# EAGLE design bal (EAGLE 8.1.1)
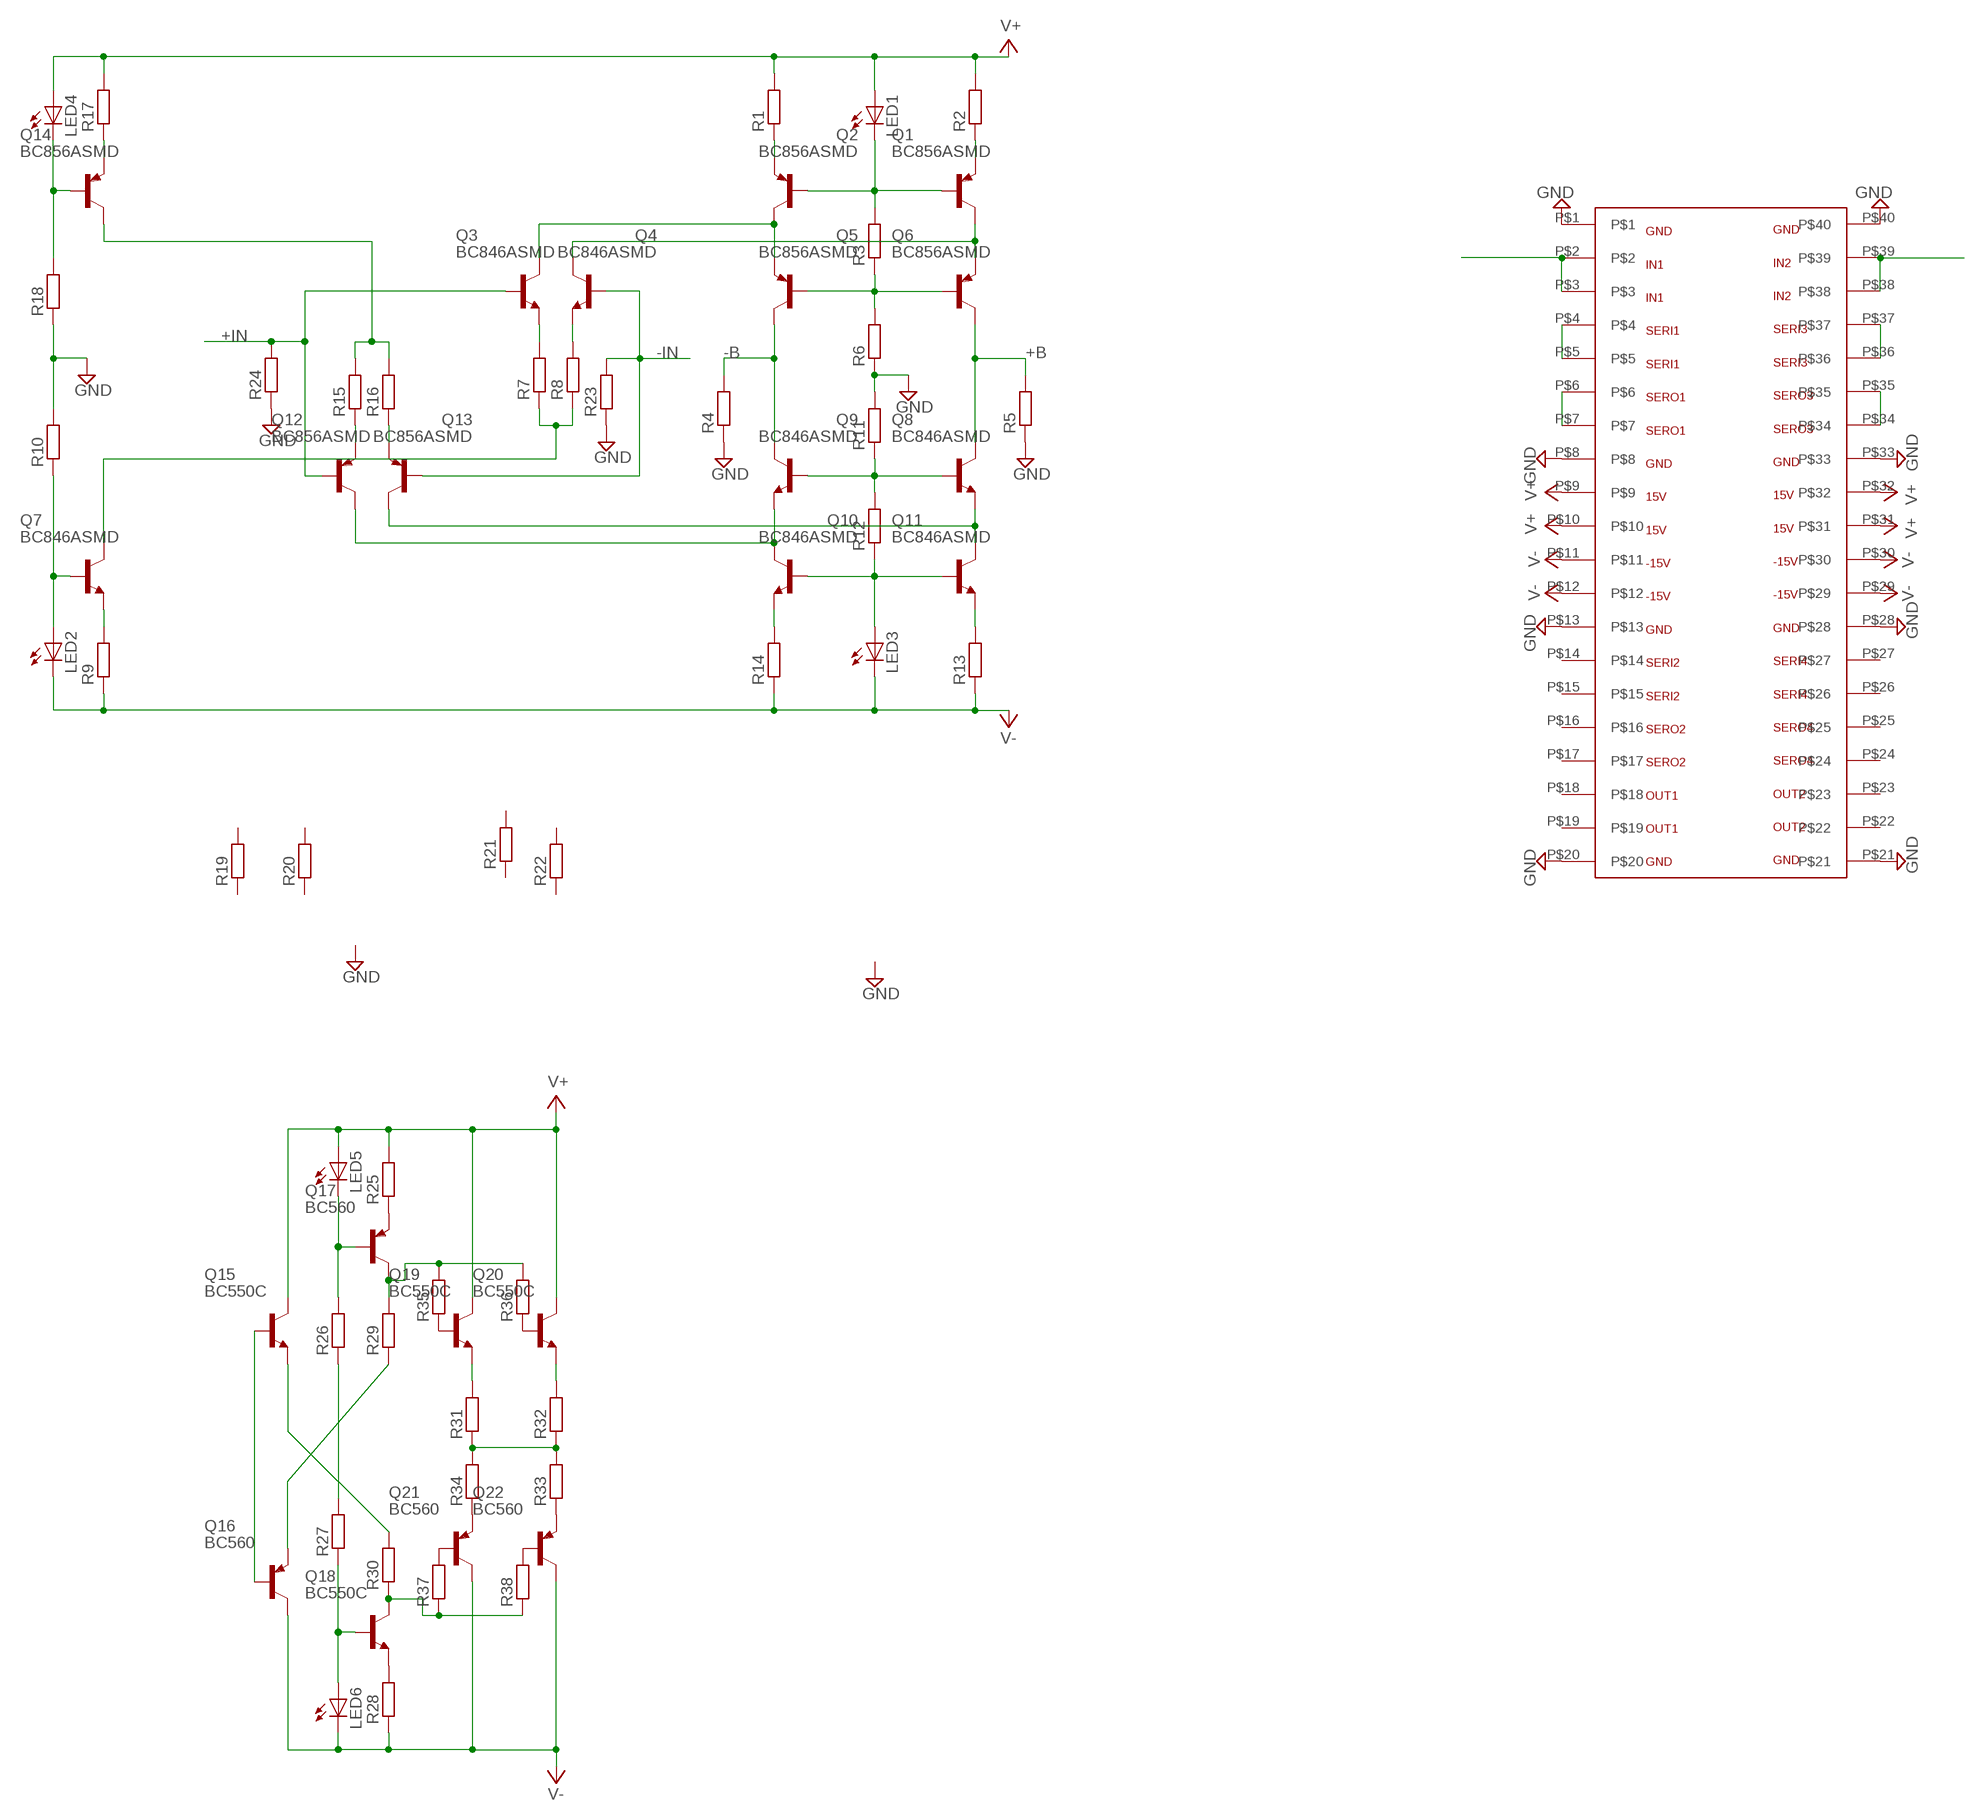
[diagram p0: schematic, sheet 1]

## Parts
LED1  LED5MM  [LED5MM]
LED2  LED5MM  [LED5MM]
LED3  LED5MM  [LED5MM]
LED4  LED5MM  [LED5MM]
LED5  LED5MM  [LED5MM]
LED6  LED5MM  [LED5MM]
Q1  BC856ASMD  [SOT23-BEC]
Q2  BC856ASMD  [SOT23-BEC]
Q3  BC846ASMD  [SOT23]
Q4  BC846ASMD  [SOT23]
Q5  BC856ASMD  [SOT23-BEC]
Q6  BC856ASMD  [SOT23-BEC]
Q7  BC846ASMD  [SOT23]
Q8  BC846ASMD  [SOT23]
Q9  BC846ASMD  [SOT23]
Q10  BC846ASMD  [SOT23]
Q11  BC846ASMD  [SOT23]
Q12  BC856ASMD  [SOT23-BEC]
Q13  BC856ASMD  [SOT23-BEC]
Q14  BC856ASMD  [SOT23-BEC]
Q15  BC550C  [TO92-EBC]
Q16  BC560  [TO92_1]
Q17  BC560  [TO92_1]
Q18  BC550C  [TO92-EBC]
Q19  BC550C  [TO92-EBC]
Q20  BC550C  [TO92-EBC]
Q21  BC560  [TO92_1]
Q22  BC560  [TO92_1]
R1  R-EU_MELF0204W  [MINI_MELF-0204W]
R2  R-EU_MELF0204W  [MINI_MELF-0204W]
R3  R-EU_MELF0204W  [MINI_MELF-0204W]
R4  R-EU_MELF0204W  [MINI_MELF-0204W]
R5  R-EU_MELF0204W  [MINI_MELF-0204W]
R6  R-EU_MELF0204W  [MINI_MELF-0204W]
R7  R-EU_MELF0204W  [MINI_MELF-0204W]
R8  R-EU_MELF0204W  [MINI_MELF-0204W]
R9  R-EU_MELF0204W  [MINI_MELF-0204W]
R10  R-EU_MELF0204W  [MINI_MELF-0204W]
R11  R-EU_MELF0204W  [MINI_MELF-0204W]
R12  R-EU_MELF0204W  [MINI_MELF-0204W]
R13  R-EU_MELF0204W  [MINI_MELF-0204W]
R14  R-EU_MELF0204W  [MINI_MELF-0204W]
R15  R-EU_MELF0204W  [MINI_MELF-0204W]
R16  R-EU_MELF0204W  [MINI_MELF-0204W]
R17  R-EU_MELF0204W  [MINI_MELF-0204W]
R18  R-EU_MELF0204W  [MINI_MELF-0204W]
R19  R-EU_MELF0204W  [MINI_MELF-0204W]
R20  R-EU_MELF0204W  [MINI_MELF-0204W]
R21  R-EU_MELF0204W  [MINI_MELF-0204W]
R22  R-EU_MELF0204W  [MINI_MELF-0204W]
R23  R-EU_MELF0204W  [MINI_MELF-0204W]
R24  R-EU_MELF0204W  [MINI_MELF-0204W]
R25  R-EU_MELF0204W  [MINI_MELF-0204W]
R26  R-EU_MELF0204W  [MINI_MELF-0204W]
R27  R-EU_MELF0204W  [MINI_MELF-0204W]
R28  R-EU_MELF0204W  [MINI_MELF-0204W]
R29  R-EU_MELF0204W  [MINI_MELF-0204W]
R30  R-EU_MELF0204W  [MINI_MELF-0204W]
R31  R-EU_MELF0204W  [MINI_MELF-0204W]
R32  R-EU_MELF0204W  [MINI_MELF-0204W]
R33  R-EU_MELF0204W  [MINI_MELF-0204W]
R34  R-EU_MELF0204W  [MINI_MELF-0204W]
R35  R-EU_MELF0204W  [MINI_MELF-0204W]
R36  R-EU_MELF0204W  [MINI_MELF-0204W]
R37  R-EU_MELF0204W  [MINI_MELF-0204W]
R38  R-EU_MELF0204W  [MINI_MELF-0204W]
U$1  VDACA  [VDACA]

## Nets
+B: Q6.C Q8.3(C) R5.2
+IN: Q3.1(B) Q12.B R24.2 U$1.P$2 U$1.P$3
-B: Q5.C Q9.3(C) R4.2
-IN: Q4.1(B) Q13.B R23.2 U$1.P$38 U$1.P$39
GND: R4.1 R5.1 R6.1 R10.2 R11.2 R18.1 R23.1 R24.1 U$1.P$1 U$1.P$8 U$1.P$13 U$1.P$20 U$1.P$21 U$1.P$28 U$1.P$33 U$1.P$40
N$1: U$1.P$4 U$1.P$5
N$2: Q1.E R2.1
N$3: Q2.E R1.1
N$4: LED1.K(C) Q1.B Q2.B R3.2
N$5: Q5.B Q6.B R3.1 R6.2
N$6: Q1.C Q4.3(C) Q6.E
N$7: Q2.C Q3.3(C) Q5.E
N$8: Q8.1(B) Q9.1(B) R11.1 R12.2
N$9: U$1.P$36 U$1.P$37
N$10: U$1.P$6 U$1.P$7
N$11: U$1.P$34 U$1.P$35
N$12: Q9.2(E) Q10.3(C) Q12.C
N$13: LED3.A Q10.1(B) Q11.1(B) R12.1
N$14: Q8.2(E) Q11.3(C) Q13.C
N$15: Q16.3(E) R29.1
N$16: Q10.2(E) R14.2
N$17: Q11.2(E) R13.2
N$19: Q4.2(E) R8.2
N$20: Q3.2(E) R7.2
N$21: Q7.3(C) R7.1 R8.1
N$22: Q14.E R17.1
N$23: LED4.K(C) Q14.B R18.2
N$24: Q7.2(E) R9.2
N$25: Q14.C R15.2 R16.2
N$26: LED2.A Q7.1(B) R10.1
N$27: LED5.K(C) Q17.2(B) R26.2
N$28: Q13.E R16.1
N$29: Q12.E R15.1
N$30: Q17.3(E) R25.1
N$31: R26.1 R27.2
N$33: Q15.E R30.2
N$34: LED6.A Q18.B R27.1
N$35: Q18.E R28.2
N$36: Q17.1(C) R29.2 R35.2 R36.2
N$37: Q18.C R30.1 R37.1 R38.1
N$38: Q15.B Q16.2(B)
N$39: Q19.E R31.2
N$40: Q20.E R32.2
N$41: Q22.3(E) R33.1
N$42: Q21.3(E) R34.1
N$43: Q21.2(B) R37.2
N$44: R31.1 R32.1 R33.2 R34.2
N$45: Q19.B R35.1
N$46: Q20.B R36.1
N$47: Q22.2(B) R38.2
V+: LED1.A LED4.A LED5.A Q15.C Q19.C Q20.C R1.2 R2.2 R17.2 R25.2 U$1.P$9 U$1.P$10 U$1.P$31 U$1.P$32
V-: LED2.K(C) LED3.K(C) LED6.K(C) Q16.1(C) Q21.1(C) Q22.1(C) R9.1 R13.1 R14.1 R28.1 U$1.P$11 U$1.P$12 U$1.P$29 U$1.P$30
Unconnected: R19.1 R19.2 R20.1 R20.2 R21.1 R21.2 R22.1 R22.2 U$1.P$14 U$1.P$15 U$1.P$16 U$1.P$17 U$1.P$18 U$1.P$19 U$1.P$22 U$1.P$23 U$1.P$24 U$1.P$25 U$1.P$26 U$1.P$27

## Library data of the parts
LED1-LED6 = led:LED: LED OSRAM: - CHIPLED LG R971, LG N971, LY N971, LG Q971, LY Q971, LO R971, LY R971 LH N974, LH R974 LS Q976, LO Q976, LY Q976 LO Q996 - Hyper CHIPLED LW Q18S LB Q993, LB Q99A, LB R99A - SideLED LS A670, LO A670, LY A670, LG A670, LP A670 LB A673, LV A673, LT A673, LW A673 LH A674 LY A675 LS A676, LA A676, LO A676, LY A676, LW A676 LS A679, LY A679, LG A679 - Hyper Micro SIDELED® LS Y876, LA Y876, LO Y876, LY Y876 LT Y87S - SmartLED LW L88C, LW L88S LB L89C, LB L89S, LG L890 LS L89K, LO L89K, LY L89K LS L896, LA L896, LO L896, LY L896 - TOPLED LS T670, LO T670, LY T670, LG T670, LP T670 LSG T670, LSP T670, LSY T670, LOP T670, LYG T670 LG T671, LOG T671, LSG T671 LB T673, LV T673, LT T673, LW T673 LH T674 LS T676, LA T676, LO T676, LY T676, LB T676, LH T676, LSB T676, LW T676 LB T67C, LV T67C, LT T67C, LS T67K, LO T67K, LY T67K, LW E67C LS E67B, LA E67B, LO E67B, LY E67B, LB E67C, LV E67C, LT E67C LW T67C LS T679, LY T679, LG T679 LS T770, LO T770, LY T770, LG T770, LP T770 LB T773, LV T773, LT T773, LW T773 LH T774 LS E675, LA E675, LY E675, LS T675 LS T776, LA T776, LO T776, LY T776, LB T776 LHGB T686 LT T68C, LB T68C - Hyper Mini TOPLED® LB M676 - Mini TOPLED Santana® LG M470 LS M47K, LO M47K, LY M47K Source: http://www.osram.convergy.de LUXEON: - LUMILED® LXK2-PW12-R00, LXK2-PW12-S00, LXK2-PW14-U00, LXK2-PW14-V00 LXK2-PM12-R00, LXK2-PM12-S00, LXK2-PM14-U00 LXK2-PE12-Q00, LXK2-PE12-R00, LXK2-PE12-S00, LXK2-PE14-T00, LXK2-PE14-U00 LXK2-PB12-K00, LXK2-PB12-L00, LXK2-PB12-M00, LXK2-PB14-N00, LXK2-PB14-P00, LXK2-PB14-Q00 LXK2-PR12-L00, LXK2-PR12-M00, LXK2-PR14-Q00, LXK2-PR14-R00 LXK2-PD12-Q00, LXK2-PD12-R00, LXK2-PD12-S00 LXK2-PH12-R00, LXK2-PH12-S00 LXK2-PL12-P00, LXK2-PL12-Q00, LXK2-PL12-R00 Source: www.luxeon.com KINGBRIGHT: KA-3528ASYC Source: www.kingbright.com
Q1 Q2 Q5 Q6 Q12-Q14 = tranzistory SMD PNP:BC856*: PNP Transistror
Q3 Q4 Q7-Q11 = tranzistory SMD NPN:BC846*: NPN Transistor
Q15 Q18-Q20 = tranzistory NPN:BC550*: NPN Transistor
Q16 Q17 Q21 Q22 = tranzistory PNP:BC560*: PNP Transistror
R1-R38 = Vwvwbg:R-EU_: RESISTOR, European symbol
U$1 = Vwvwbg:VDACA

## Board
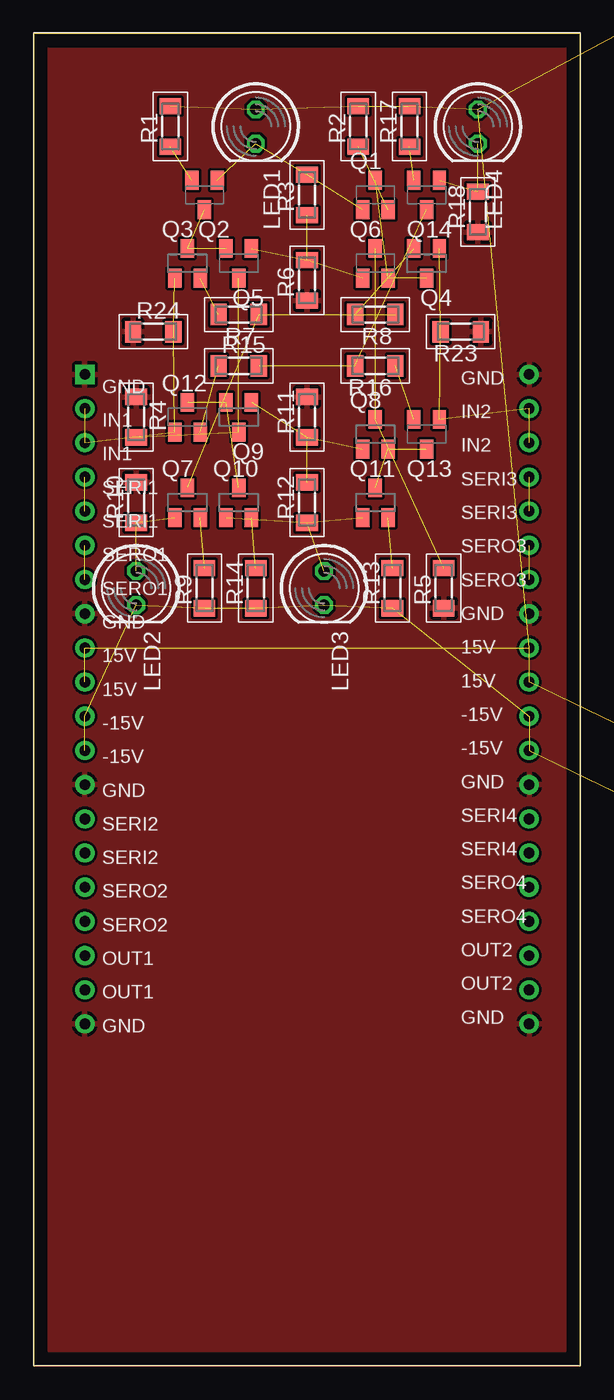
[diagram p1: board, top side]

Size 40.63 x 98.97 mm. Coordinates in mm from the lower left corner, seen from the top.
Outline: 0,0 40.63,0 40.63,98.97 0,98.97 0,0
Copper layers (1*16): Top 0.035mm / dielectric 1.5mm / Bottom 0.035mm
Design rules "default": minimum track width 10mil, minimum drill 24mil, track to track 8mil, track to pad 8mil, pad to pad 8mil, via to via 8mil, smd to smd 8mil, copper to edge 40mil, drill to drill 8mil, minimum pad ring 10mil, minimum via ring 8mil, stop-mask expansion 4mil, vias tented up to drill 0mil, thermal gap 10mil

### Footprints (pad centres in the part's own frame; a part is rotated, then mirrored left to right if it is on the bottom)
LED5MM = drill 0.813 octagon: A -1.27,0; K 1.27,0
SOT23-BEC = smd 1 x 1.4: B -0.95,-1.1; C 0,1.1; E 0.95,-1.1
SOT23 = smd 1 x 1.4: 1 -0.95,-1.1; 2 0.95,-1.1; 3 0,1.1
TO92-EBC = drill 0.813 pad 1.422: B 0,-1.27; C -2.54,-1.27; E 2.54,-1.27
TO92_1 = drill 0.813 pad 1.422: 1 -2.54,0; 2 0,0; 3 2.54,0
MINI_MELF-0204W = smd 1.2 x 1.6: 1 -1.5,0; 2 1.5,0
VDACA = drill 0.8 pad 1.422 square: P$1 1.27,-19.05 | drill 0.8 pad 1.422: P$2 1.27,-21.59; P$3 1.27,-24.13; P$4 1.27,-26.67; P$5 1.27,-29.21; P$6 1.27,-31.75; P$7 1.27,-34.29; P$8 1.27,-36.83; P$9 1.27,-39.37; P$10 1.27,-41.91; P$11 1.27,-44.45; P$12 1.27,-46.99; P$13 1.27,-49.53; P$14 1.27,-52.07; P$15 1.27,-54.61; P$16 1.27,-57.15; P$17 1.27,-59.69; P$18 1.27,-62.23; P$19 1.27,-64.77; P$20 1.27,-67.31; P$21 34.29,-67.31; P$22 34.29,-64.77; P$23 34.29,-62.23; P$24 34.29,-59.69; P$25 34.29,-57.15; P$26 34.29,-54.61; P$27 34.29,-52.07; P$28 34.29,-49.53; P$29 34.29,-46.99; P$30 34.29,-44.45; P$31 34.29,-41.91; P$32 34.29,-39.37; P$33 34.29,-36.83; P$34 34.29,-34.29; P$35 34.29,-31.75; P$36 34.29,-29.21; P$37 34.29,-26.67; P$38 34.29,-24.13; P$39 34.29,-21.59; P$40 34.29,-19.05

### Placement (x,y rotation side)
LED1  16.51,92.08 270 top
LED2  7.62,57.78 270 top
LED3  21.59,57.78 270 top
LED4  33.02,92.08 270 top
LED5  130.81,7.62 90 top  (outside the outline)
LED6  104.14,8.89 270 top  (outside the outline)
Q1  25.4,87 0 top
Q2  12.7,87 180 top
Q3  11.43,81.92 0 top
Q4  29.21,81.92 180 top
Q5  15.24,81.92 180 top
Q6  25.4,81.92 0 top
Q7  11.43,64.14 0 top
Q8  25.4,69.22 0 top
Q9  15.24,70.48 180 top
Q10  15.24,64.14 0 top
Q11  25.4,64.14 0 top
Q12  11.43,70.48 0 top
Q13  29.21,69.22 180 top
Q14  29.21,87 180 top
Q15  110.49,17.78 0 top  (outside the outline)
Q16  124.46,16.51 180 top  (outside the outline)
Q17  124.46,11.43 0 top  (outside the outline)
Q18  110.49,11.43 180 top  (outside the outline)
Q19  127,1.27 180 top  (outside the outline)
Q20  127,-3.81 180 top  (outside the outline)
Q21  109.22,2.54 0 top  (outside the outline)
Q22  109.22,-2.54 0 top  (outside the outline)
R1  10.16,92.08 90 top
R2  24.13,92.08 90 top
R3  20.32,87 90 top
R4  7.62,70.48 270 top
R5  30.48,57.78 90 top
R6  20.32,80.64 90 top
R7  15.24,78.11 180 top
R8  25.4,78.11 180 top
R9  12.7,57.78 90 top
R10  7.62,64.14 90 top
R11  20.32,70.48 90 top
R12  20.32,64.14 90 top
R13  26.67,57.78 90 top
R14  16.51,57.78 90 top
R15  15.24,74.3 0 top
R16  25.4,74.3 180 top
R17  27.94,92.08 90 top
R18  33.02,85.72 90 top
R19  -35.56,45.72 0 top  (outside the outline)
R20  -41.91,45.72 0 top  (outside the outline)
R21  -41.91,-5.08 0 top  (outside the outline)
R22  -41.91,-11.43 0 top  (outside the outline)
R23  31.75,76.83 180 top
R24  8.89,76.83 0 top
R25  96.52,128.27 0 top  (outside the outline)
R26  96.52,107.95 0 top  (outside the outline)
R27  96.52,101.6 0 top  (outside the outline)
R28  104.14,13.97 0 top  (outside the outline)
R29  119.38,13.97 270 top  (outside the outline)
R30  115.57,13.97 90 top  (outside the outline)
R31  120.65,2.54 0 top  (outside the outline)
R32  120.65,-2.54 0 top  (outside the outline)
R33  115.57,-2.54 0 top  (outside the outline)
R34  115.57,2.54 0 top  (outside the outline)
R35  124.46,7.62 180 top  (outside the outline)
R36  124.46,-6.35 180 top  (outside the outline)
R37  110.49,7.62 180 top  (outside the outline)
R38  110.49,-6.35 180 top  (outside the outline)
U$1  2.54,92.71 0 top

### Tracks (layer width: path | path; a pad name or v marks a point on that pad's centre or on a via)
+B  (2 unrouted)
+IN  (4 unrouted)
-B  (2 unrouted)
-IN  (4 unrouted)
GND
  pour Top: -2.54,102.23 52.07,102.23 52.07,-3.17 -2.54,-3.17
N$1  (1 unrouted)
N$2  (1 unrouted)
N$3  (1 unrouted)
N$4  (3 unrouted)
N$5  (3 unrouted)
N$6  (2 unrouted)
N$7  (2 unrouted)
N$8  (3 unrouted)
N$9  (1 unrouted)
N$10  (1 unrouted)
N$11  (1 unrouted)
N$12  (2 unrouted)
N$13  (3 unrouted)
N$14  (2 unrouted)
N$15  (1 unrouted)
N$16  (1 unrouted)
N$17  (1 unrouted)
N$19  (1 unrouted)
N$20  (1 unrouted)
N$21  (2 unrouted)
N$22  (1 unrouted)
N$23  (2 unrouted)
N$24  (1 unrouted)
N$25  (2 unrouted)
N$26  (2 unrouted)
N$27  (2 unrouted)
N$28  (1 unrouted)
N$29  (1 unrouted)
N$30  (1 unrouted)
N$31  (1 unrouted)
N$33  (1 unrouted)
N$34  (2 unrouted)
N$35  (1 unrouted)
N$36  (3 unrouted)
N$37  (3 unrouted)
N$38  (1 unrouted)
N$39  (1 unrouted)
N$40  (1 unrouted)
N$41  (1 unrouted)
N$42  (1 unrouted)
N$43  (1 unrouted)
N$44  (3 unrouted)
N$45  (1 unrouted)
N$46  (1 unrouted)
N$47  (1 unrouted)
V+  (13 unrouted)
V-  (13 unrouted)